# EAGLE design blues-hardware (EAGLE 9.6.2)
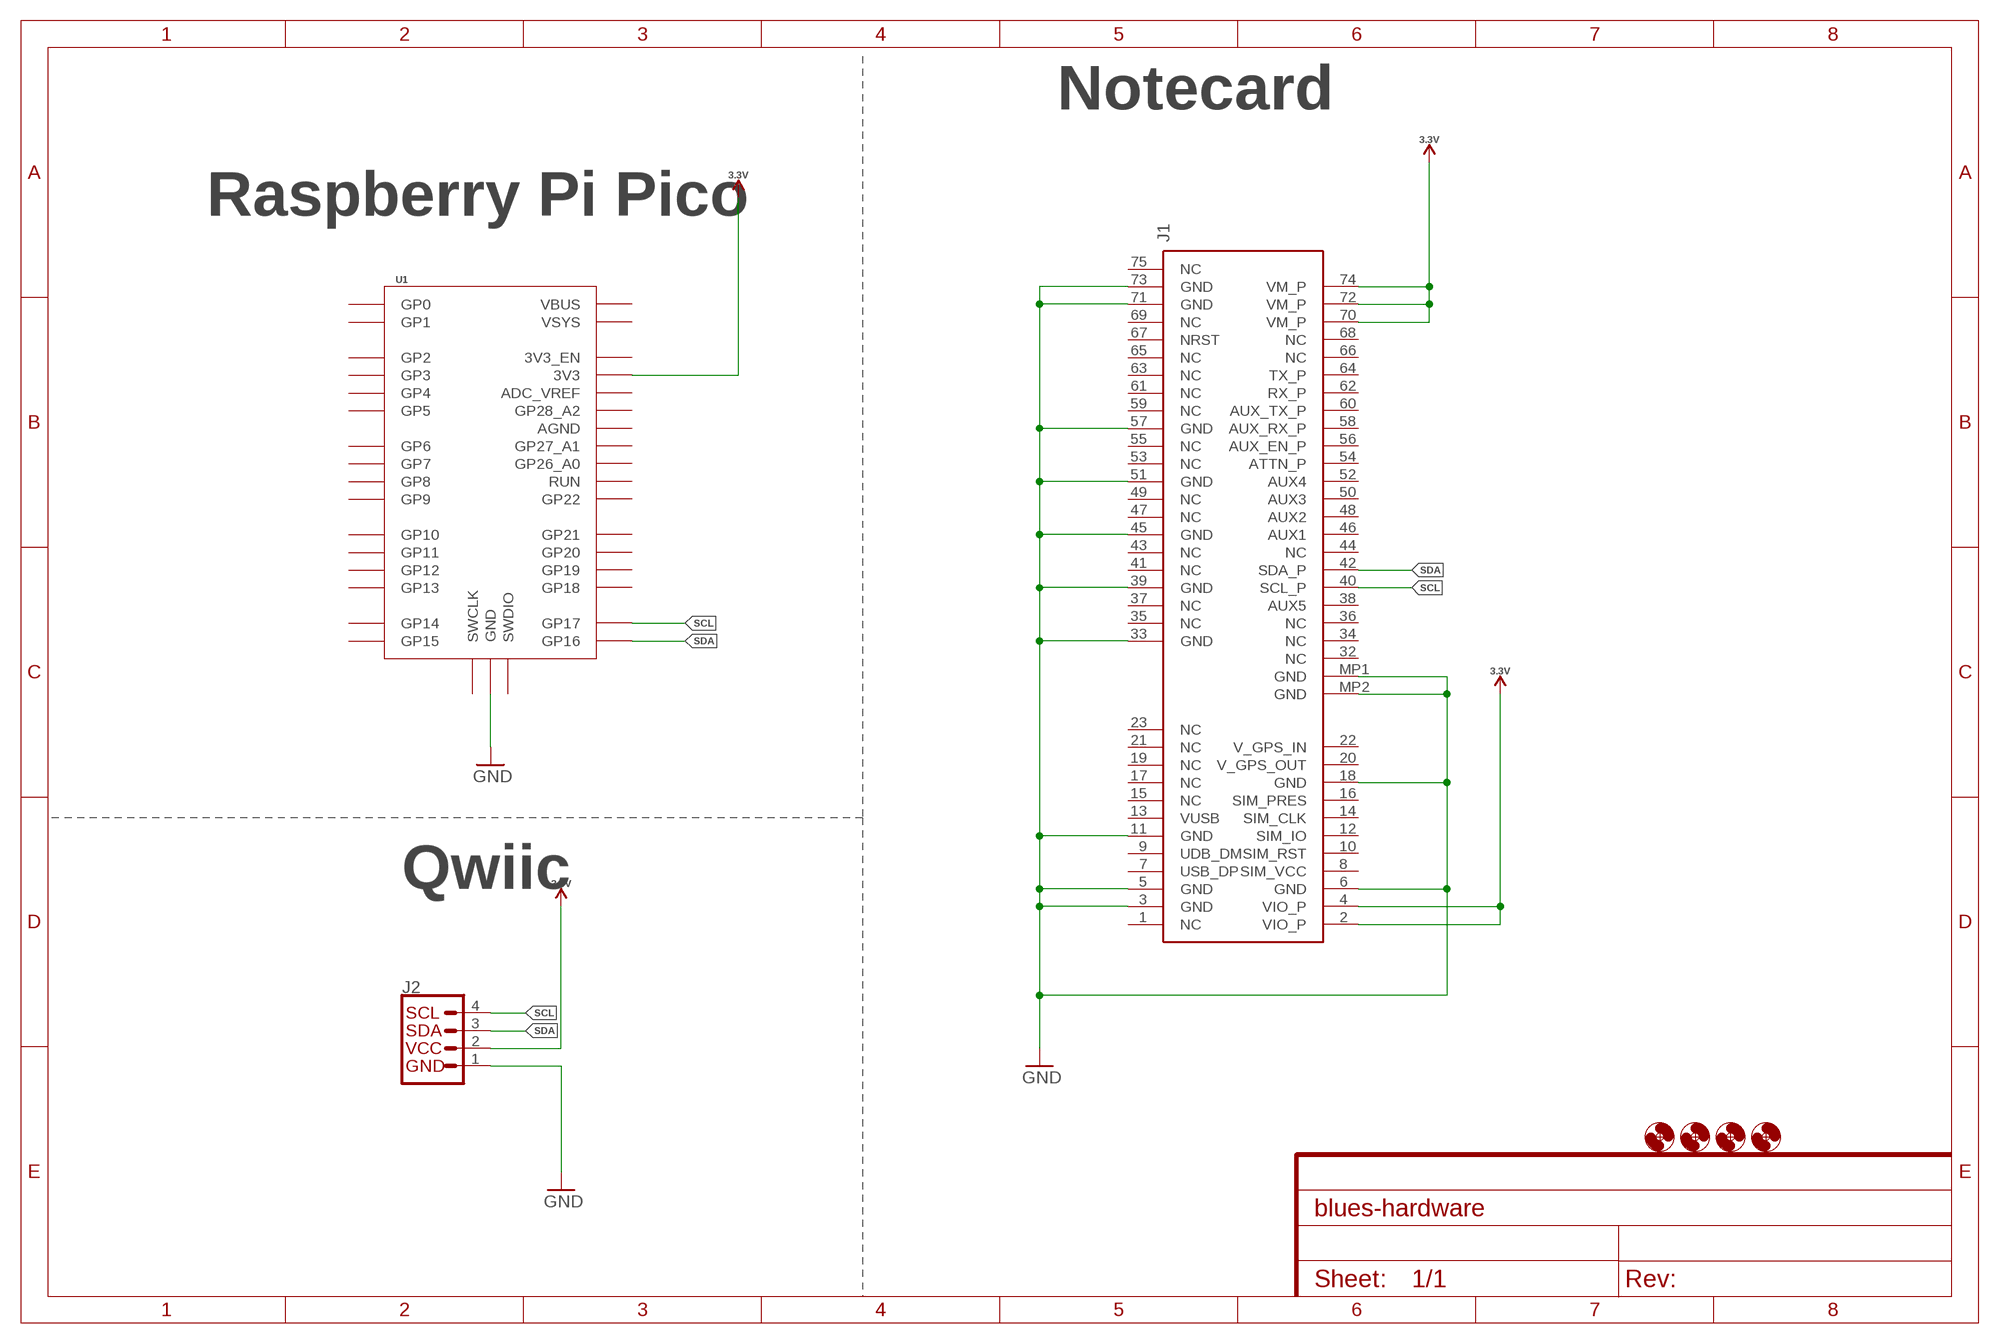
[diagram p0: schematic, sheet 1]

## Parts
H1  MOUNT-HOLE3.0  [3,0]
H2  MOUNT-HOLE3.0  [3,0]
H3  MOUNT-HOLE3.0  [3,0]
H4  MOUNT-HOLE3.0  [3,0]
J1  MDT420E01001NOTECARD  [NOTECARD]
J2  QWIIC_CONNECTORJS-1MM  [1X04_1MM_RA]
U1  RPI_PICO-TH  [RPI_PICO_TH]

## Nets
3.3V: J1.2(VIO_P) J1.4(VIO_P) J1.70(VM_P) J1.72(VM_P) J1.74(VM_P) J2.2 U1.3V3
GND: J1.3(GND) J1.5(GND) J1.6(GND) J1.11(GND) J1.18(GND) J1.33(GND) J1.39(GND) J1.45(GND) J1.51(GND) J1.57(GND) J1.71(GND) J1.73(GND) J1.MP1(GND) J1.MP2(GND) J2.1 U1.GND@1(GND) U1.GND@2(GND) U1.GND@3(GND) U1.GND@4(GND) U1.GND@5(GND) U1.GND@6(GND) U1.GND@7(GND) U1.GND@8(GND)
SCL: J1.40(SCL_P) J2.4 U1.GP17
SDA: J1.42(SDA_P) J2.3 U1.GP16
Unconnected: J1.1(NC) J1.7(USB_DP) J1.8(SIM_VCC) J1.9(UDB_DM) J1.10(SIM_RST) J1.12(SIM_IO) J1.13(VUSB) J1.14(SIM_CLK) J1.15(NC) J1.16(SIM_PRES) J1.17(NC) J1.19(NC) J1.20(V_GPS_OUT) J1.21(NC) J1.22(V_GPS_IN) J1.23(NC) J1.32(NC) J1.34(NC) J1.35(NC) J1.36(NC) J1.37(NC) J1.38(AUX5) J1.41(NC) J1.43(NC) J1.44(NC) J1.46(AUX1) J1.47(NC) J1.48(AUX2) J1.49(NC) J1.50(AUX3) J1.52(AUX4) J1.53(NC) J1.54(ATTN_P) J1.55(NC) J1.56(AUX_EN_P) J1.58(AUX_RX_P) J1.59(NC) J1.60(AUX_TX_P) J1.61(NC) J1.62(RX_P) J1.63(NC) J1.64(TX_P) J1.65(NC) J1.66(NC) J1.67(NRST) J1.68(NC) J1.69(NC) J1.75(NC) U1.3V3_EN U1.ADC_VREF U1.AGND U1.GP0 U1.GP1 U1.GP2 U1.GP3 U1.GP4 U1.GP5 U1.GP6 U1.GP7 U1.GP8 U1.GP9 U1.GP10 U1.GP11 U1.GP12 U1.GP13 U1.GP14 U1.GP15 U1.GP18 U1.GP19 U1.GP20 U1.GP21 U1.GP22 U1.GP26_A0 U1.GP27_A1 U1.GP28_A2 U1.RUN U1.SWCLK U1.SWDIO U1.VBUS U1.VSYS

## Notes on the sheet
- Notecard
- Raspberry Pi Pico
- Qwiic

## Library data of the parts
H1-H4 = holes:MOUNT-HOLE: MOUNTING HOLE with drill center marker
J1 = notecard:MDT420E01001: PCI Express / PCI Connectors 67P SMT RCPT H4.20 E Key, 30u" Au Source: Datasheet <https://componentsearchengine.com/Datasheets/1/MDT420E01001.pdf>
J2 = SparkFun-Connectors:QWIIC_CONNECTOR: SparkFun I2C Standard Qwiic Connector An SMD 1mm pitch JST connector makes it easy and quick (get it? Qwiic?) to connect I2C devices to each other. The Qwiic system <http://www.sparkfun.com/qwiic> enables fast and solderless connection between popular platforms and various sensors and actuators. We carry 200mm <https://www.sparkfun.com/products/14204>, 100mm <https://www.sparkfun.com/products/14205>, 50mm <https://www.sparkfun.com/products/14206>, and breadboard friendly <https://www.sparkfun.com/products/14207> Qwiic cables. We also offer 10 pcs strips <https://www.sparkfun.com/products/14323> the SMD connectors.; PROD_ID: CONN-13694
U1 = RaspberryPi_Pico:RPI_PICO

## Board
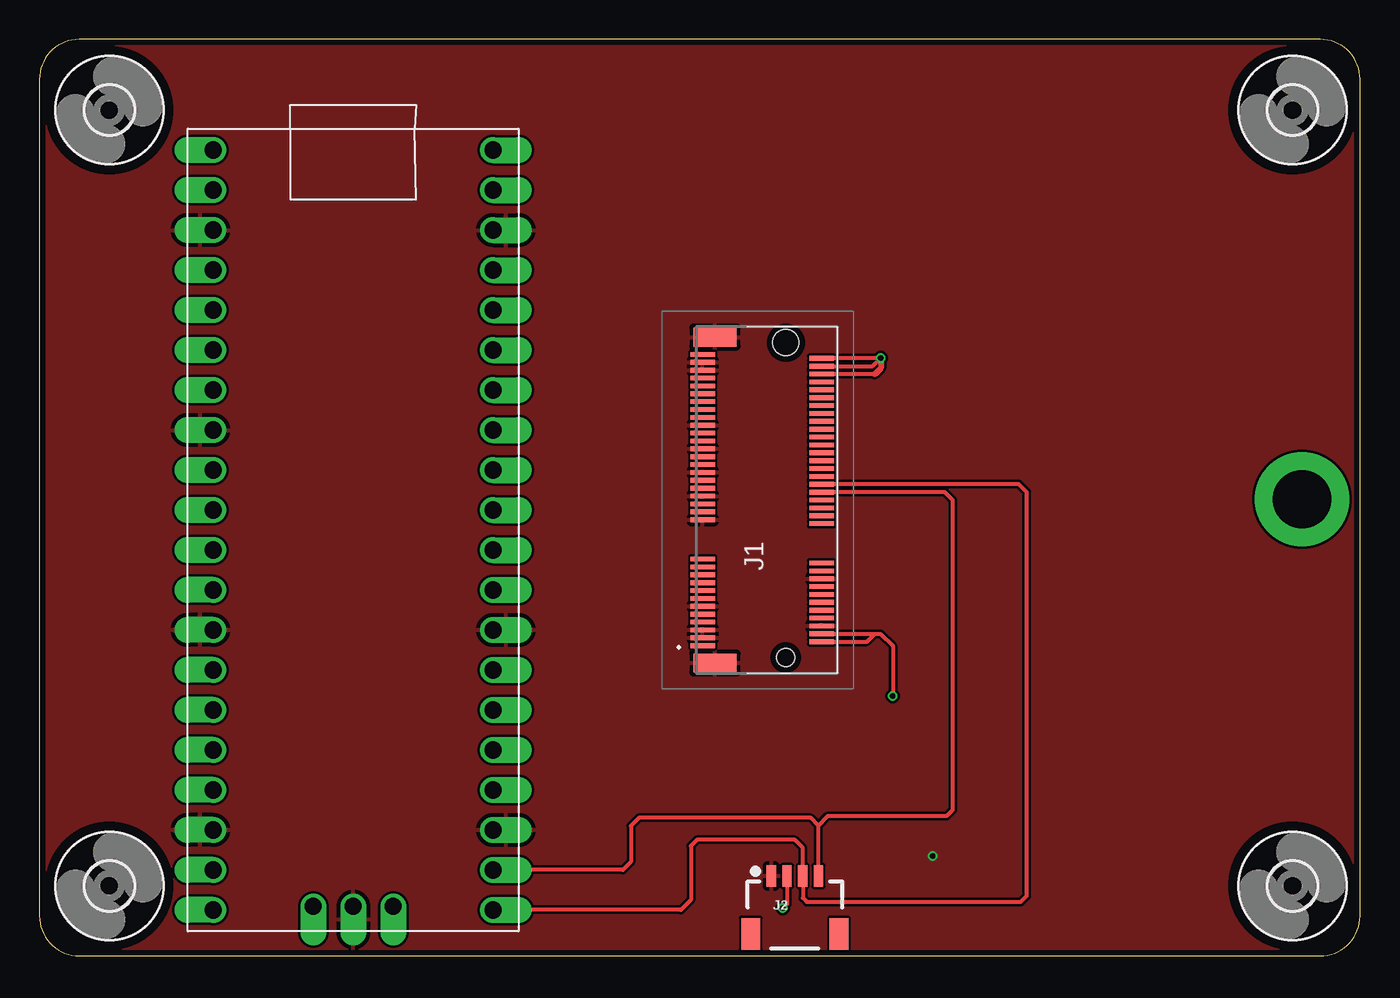
[diagram p1: board, top side]
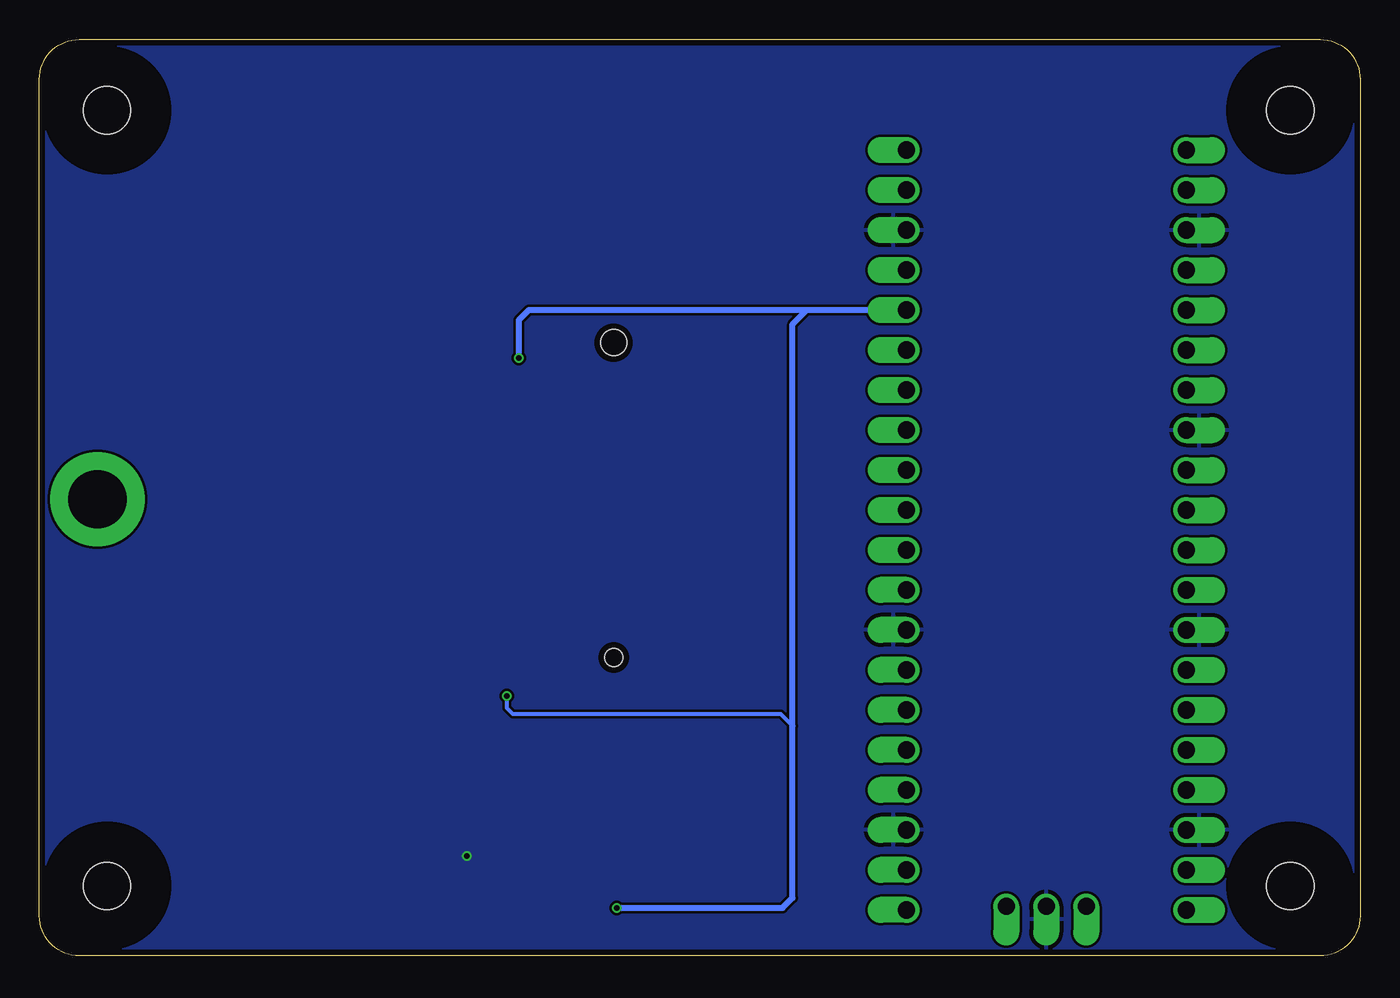
[diagram p2: board, bottom side, seen from below]

Size 83.93 x 58.22 mm. Coordinates in mm from the lower left corner, seen from the top.
Outline: 0,55.68 0,2.54 arc90 2.54,0 81.39,0 arc90 83.93,2.54 83.93,55.68 arc90 81.39,58.22 2.54,58.22 arc90 0,55.68
Copper layers (1*16): Top 0.035559375mm / dielectric 1.6mm / Bottom 0.035559375mm
Design rules "oshpark-2layer": minimum track width 6mil, minimum drill 10mil, track to track 6mil, track to pad 6mil, pad to pad 6mil, via to via 6mil, smd to smd 6mil, copper to edge 15mil, drill to drill 6mil, minimum pad ring 5mil, minimum via ring 5mil, stop-mask expansion 2.5mil, vias tented up to drill 0mil, thermal gap 10mil

### Footprints (pad centres in the part's own frame; a part is rotated, then mirrored left to right if it is on the bottom)
3,0 = hole 3: 0,0
NOTECARD = smd 0.3 x 1.55: 1 -9.25,4.075; 2 -9,-3.475; 3 -8.75,4.075; 4 -8.5,-3.475; 5 -8.25,4.075; 6 -8,-3.475; 7 -7.75,4.075; 8 -7.5,-3.475; 9 -7.25,4.075; 10 -7,-3.475; 11 -6.75,4.075; 12 -6.5,-3.475; 13 -6.25,4.075; 14 -6,-3.475; 15 -5.75,4.075; 16 -5.5,-3.475; 17 -5.25,4.075; 18 -5,-3.475; 19 -4.75,4.075; 20 -4.5,-3.475; 21 -4.25,4.075; 22 -4,-3.475; 23 -3.75,4.075; 32 -1.5,-3.475; 33 -1.25,4.075; 34 -1,-3.475; 35 -0.75,4.075; 36 -0.5,-3.475; 37 -0.25,4.075; 38 0,-3.475; 39 0.25,4.075; 40 0.5,-3.475; 41 0.75,4.075; 42 1,-3.475; 43 1.25,4.075; 44 1.5,-3.475; 45 1.75,4.075; 46 2,-3.475; 47 2.25,4.075; 48 2.5,-3.475; 49 2.75,4.075; 50 3,-3.475; 51 3.25,4.075; 52 3.5,-3.475; 53 3.75,4.075; 54 4,-3.475; 55 4.25,4.075; 56 4.5,-3.475; 57 4.75,4.075; 58 5,-3.475; 59 5.25,4.075; 60 5.5,-3.475; 61 5.75,4.075; 62 6,-3.475; 63 6.25,4.075; 64 6.5,-3.475; 65 6.75,4.075; 66 7,-3.475; 67 7.25,4.075; 68 7.5,-3.475; 69 7.75,4.075; 70 8,-3.475; 71 8.25,4.075; 72 8.5,-3.475; 73 8.75,4.075; 74 9,-3.475; 75 9.25,4.075 | smd 1.2 x 2.75: MP1 -10.35,3.3; MP2 10.35,3.3 | drill 3.7 pad 6: P$1 0.05,-34 | hole 1.15: -10,-1.2 | hole 1.65: 10,-1.2
1X04_1MM_RA = smd 0.6 x 1.35: 1 -1.5,0; 2 -0.5,0; 3 0.5,0; 4 1.5,0 | smd 1.2 x 2: NC1 2.8,-3.675; NC2 -2.8,-3.675
RPI_PICO_TH = drill 1.1 pad 1.6 offset: 3V3 8.89,13.97; 3V3_EN 8.89,16.51; ADC_VREF 8.89,11.43; AGND 8.89,6.35; GND@1 -8.89,19.05; GND@2 -8.89,6.35; GND@3 -8.89,-6.35; GND@4 -8.89,-19.05; GND@5 0,-23.9; GND@6 8.89,-19.05; GND@7 8.89,-6.35; GND@8 8.89,19.05; GP0 -8.89,24.13; GP1 -8.89,21.59; GP2 -8.89,16.51; GP3 -8.89,13.97; GP4 -8.89,11.43; GP5 -8.89,8.89; GP6 -8.89,3.81; GP7 -8.89,1.27; GP8 -8.89,-1.27; GP9 -8.89,-3.81; GP10 -8.89,-8.89; GP11 -8.89,-11.43; GP12 -8.89,-13.97; GP13 -8.89,-16.51; GP14 -8.89,-21.59; GP15 -8.89,-24.13; GP16 8.89,-24.13; GP17 8.89,-21.59; GP18 8.89,-16.51; GP19 8.89,-13.97; GP20 8.89,-11.43; GP21 8.89,-8.89; GP22 8.89,-3.81; GP26_A0 8.89,1.27; GP27_A1 8.89,3.81; GP28_A2 8.89,8.89; RUN 8.89,-1.27; SWCLK -2.54,-23.9; SWDIO 2.54,-23.9; VBUS 8.89,24.13; VSYS 8.89,21.59

### Placement (x,y rotation side)
H1  4.45,4.45 0 top
H2  79.63,4.45 0 top
H3  79.63,53.72 0 top
H4  4.45,53.72 0 top
J1  46.23,28.96 90 top
J2  48.01,5.08 0 top
U1  19.94,27.05 0 top

### Tracks (layer width: path | path; a pad name or v marks a point on that pad's centre or on a via)
3.3V  (via drill 0.35)
  Top 0.254: 53.09,36.96 53.08,36.96 J1.70 | J1.72 52.95,37.46 v53.47,37.97 49.72,37.97 J1.74 | J2.2 47.51,3.31 v47.24,3.05 | J1.4 53.09,20.46 | 53.09,20.46 53.46,20.46 54.23,19.68 v54.23,16.51 | J1.2 52.59,19.96 53.09,20.46
  Top 0.381: v53.47,37.97 53.47,37.34 53.09,36.96
  Bottom 0.254: v54.23,16.51 54.23,15.75 53.85,15.37 36.83,15.37 36.07,14.61
  Bottom 0.381: U1.3V3 35.18,41.02 | 35.18,41.02 52.83,41.02 53.47,40.39 v53.47,37.97 | v47.24,3.05 36.7,3.05 36.07,3.68 36.07,14.61 36.07,40.13 35.18,41.02
GND  (via drill 0.35)
  other vias: 56.77,6.35
  pour Top: -5.46,0 -5.46,58.17 81.41,58.17 arc-90 83.95,55.63 83.95,0
  pour Bottom: -5.46,0 -5.46,58.17 81.41,58.17 arc-90 83.95,55.63 83.95,2.54 arc-90 81.41,0
SCL
  Top 0.254: J2.4 49.51,8.28 | 49.51,8.28 49.02,8.76 38.1,8.76 37.59,8.26 37.59,5.97 37.08,5.46 U1.GP17 | 49.51,8.28 50.12,8.89 57.66,8.89 58.04,9.27 58.04,28.96 57.53,29.46 49.71,29.46 J1.40
SDA
  Top 0.254: U1.GP16 40.77,2.92 41.4,3.56 41.4,6.99 41.78,7.37 48.01,7.37 48.51,6.87 J2.3 48.51,3.69 48.77,3.43 62.36,3.43 62.74,3.81 62.74,29.46 62.23,29.97 49.72,29.97 J1.42